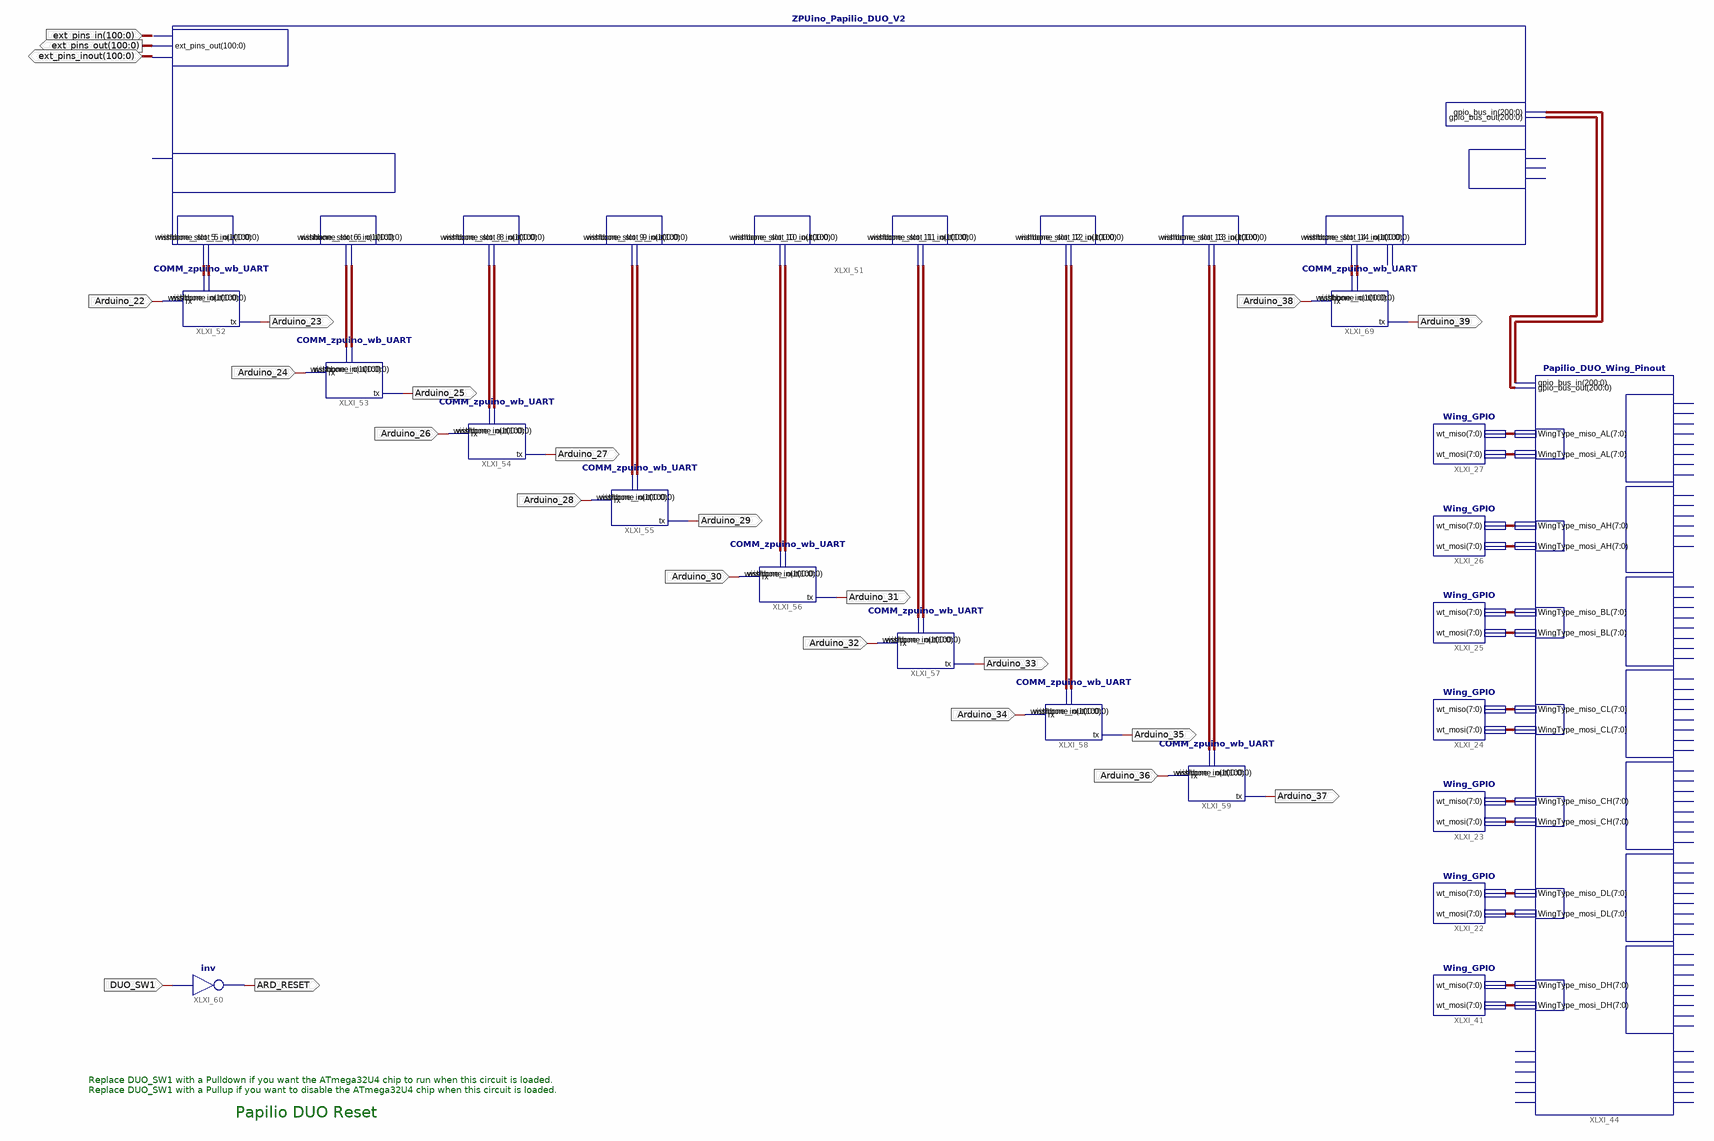
[diagram p0: schematic sheet 1]
// Xilinx ISE schematic Papilio_DUO_LX9.sch (spartan6) as structural Verilog: 19 symbols, 23 ports
module Papilio_DUO_LX9 (
  input  [100:0] ext_pins_in,
  input  DUO_SW1,
  input  Arduino_22,
  input  Arduino_38,
  input  Arduino_24,
  input  Arduino_26,
  input  Arduino_28,
  input  Arduino_30,
  input  Arduino_32,
  input  Arduino_34,
  input  Arduino_36,
  inout  [100:0] ext_pins_inout,
  output [100:0] ext_pins_out,
  output ARD_RESET,
  output Arduino_23,
  output Arduino_25,
  output Arduino_27,
  output Arduino_29,
  output Arduino_31,
  output Arduino_33,
  output Arduino_35,
  output Arduino_37,
  output Arduino_39
);

  wire [7:0] XLXN_325, XLXN_326, XLXN_327, XLXN_328, XLXN_329, XLXN_330, XLXN_331, XLXN_332, XLXN_333,
       XLXN_334, XLXN_335, XLXN_336, XLXN_448, XLXN_449;
  wire [100:0] XLXN_481, XLXN_482, XLXN_483, XLXN_484, XLXN_485, XLXN_486, XLXN_487, XLXN_488, XLXN_489,
       XLXN_490, XLXN_491, XLXN_492, XLXN_493, XLXN_494, XLXN_495, XLXN_496, XLXN_497, XLXN_498;
  wire [200:0] XLXN_522, XLXN_523;

  ZPUino_Papilio_DUO_V2 XLXI_51 (
    .gpio_bus_out(XLXN_523), .gpio_bus_in(XLXN_522), .ext_pins_in(ext_pins_in), .ext_pins_out(ext_pins_out),
    .ext_pins_inout(ext_pins_inout), .wishbone_slot_5_out(XLXN_482), .wishbone_slot_5_in(XLXN_481),
    .wishbone_slot_6_in(XLXN_483), .wishbone_slot_6_out(XLXN_484), .wishbone_slot_8_in(XLXN_485),
    .wishbone_slot_8_out(XLXN_486), .wishbone_slot_9_in(XLXN_487), .wishbone_slot_9_out(XLXN_488),
    .wishbone_slot_10_in(XLXN_489), .wishbone_slot_10_out(XLXN_490), .wishbone_slot_11_in(XLXN_491),
    .wishbone_slot_11_out(XLXN_492), .wishbone_slot_12_in(XLXN_493), .wishbone_slot_12_out(XLXN_494),
    .wishbone_slot_13_in(XLXN_495), .wishbone_slot_13_out(XLXN_496), .wishbone_slot_14_in(XLXN_497),
    .wishbone_slot_14_out(XLXN_498));  // open: clk_96Mhz, clk_1Mhz, clk_osc_32Mhz, AVR_Wishbone_Bridge_Enable, wishbone_slot_video_in, wishbone_slot_video_out
  Wing_GPIO XLXI_27 (.wt_miso(XLXN_335), .wt_mosi(XLXN_336));
  Wing_GPIO XLXI_26 (.wt_miso(XLXN_333), .wt_mosi(XLXN_334));
  Wing_GPIO XLXI_25 (.wt_miso(XLXN_331), .wt_mosi(XLXN_332));
  Wing_GPIO XLXI_24 (.wt_miso(XLXN_329), .wt_mosi(XLXN_330));
  Wing_GPIO XLXI_23 (.wt_miso(XLXN_327), .wt_mosi(XLXN_328));
  Wing_GPIO XLXI_22 (.wt_miso(XLXN_325), .wt_mosi(XLXN_326));
  Wing_GPIO XLXI_41 (.wt_miso(XLXN_448), .wt_mosi(XLXN_449));
  Papilio_DUO_Wing_Pinout XLXI_44 (
    .gpio_bus_out(XLXN_523), .gpio_bus_in(XLXN_522), .WingType_miso_BL(XLXN_331),
    .WingType_miso_AH(XLXN_333), .WingType_mosi_BL(XLXN_332), .WingType_mosi_AH(XLXN_334),
    .WingType_mosi_AL(XLXN_336), .WingType_miso_AL(XLXN_335), .WingType_mosi_CL(XLXN_330),
    .WingType_miso_CL(XLXN_329), .WingType_miso_CH(XLXN_327), .WingType_mosi_CH(XLXN_328),
    .WingType_mosi_DL(XLXN_326), .WingType_mosi_DH(XLXN_449), .WingType_miso_DH(XLXN_448),
    .WingType_miso_DL(XLXN_325));  // open: WING_AH0, WING_AH1, WING_AH2, WING_AH3, WING_AH4, WING_AH5, WING_AL0, WING_AL1, WING_AL2, WING_AL3, WING_AL4, WING_AL5, WING_BL0, WING_BL1, WING_BL2, WING_BL3, WING_BL4, WING_BL5, WING_BL6, WING_BL7, WING_CL0, WING_CL1, WING_CL2, WING_CL3, WING_CL4, WING_CL5, WING_CL6, WING_CL7, WING_CH0, WING_CH1, WING_CH2, WING_CH3, WING_CH4, WING_CH5, WING_CH6, WING_CH7, WING_DL0, WING_DL1, WING_DL2, WING_DL3, WING_DL4, WING_DL5, WING_DL6, WING_DL7, WING_DH0, WING_DH1, WING_DH2, WING_DH3, WING_DH4, WING_DH5, WING_DH6, WING_DH7, WING_AL7, WING_AL6, Flex_Pin_out_0, Flex_Pin_out_1, Flex_Pin_out_2, Flex_Pin_out_3, Flex_Pin_out_4, Flex_Pin_out_5, Flex_Pin_in_0, Flex_Pin_in_1, Flex_Pin_in_2, Flex_Pin_in_3, Flex_Pin_in_4, Flex_Pin_in_5
  not XLXI_60 (ARD_RESET, DUO_SW1);
  COMM_zpuino_wb_UART XLXI_52 (.rx(Arduino_22), .wishbone_in(XLXN_481), .wishbone_out(XLXN_482), .tx(Arduino_23));
  COMM_zpuino_wb_UART XLXI_53 (.rx(Arduino_24), .wishbone_in(XLXN_483), .wishbone_out(XLXN_484), .tx(Arduino_25));
  COMM_zpuino_wb_UART XLXI_54 (.rx(Arduino_26), .wishbone_in(XLXN_485), .wishbone_out(XLXN_486), .tx(Arduino_27));
  COMM_zpuino_wb_UART XLXI_55 (.rx(Arduino_28), .wishbone_in(XLXN_487), .wishbone_out(XLXN_488), .tx(Arduino_29));
  COMM_zpuino_wb_UART XLXI_56 (.rx(Arduino_30), .wishbone_in(XLXN_489), .wishbone_out(XLXN_490), .tx(Arduino_31));
  COMM_zpuino_wb_UART XLXI_57 (.rx(Arduino_32), .wishbone_in(XLXN_491), .wishbone_out(XLXN_492), .tx(Arduino_33));
  COMM_zpuino_wb_UART XLXI_58 (.rx(Arduino_34), .wishbone_in(XLXN_493), .wishbone_out(XLXN_494), .tx(Arduino_35));
  COMM_zpuino_wb_UART XLXI_59 (.rx(Arduino_36), .wishbone_in(XLXN_495), .wishbone_out(XLXN_496), .tx(Arduino_37));
  COMM_zpuino_wb_UART XLXI_69 (.rx(Arduino_38), .wishbone_in(XLXN_497), .wishbone_out(XLXN_498), .tx(Arduino_39));

  // Notes on the sheet:
  //   Replace DUO_SW1 with a Pulldown if you want the ATmega32U4 chip to run when this circuit is loaded.
  //   Replace DUO_SW1 with a Pullup if you want to disable the ATmega32U4 chip when this circuit is loaded.
  //   Papilio DUO Reset
endmodule
